# EAGLE design shieldArduino (EAGLE 9.6.2)
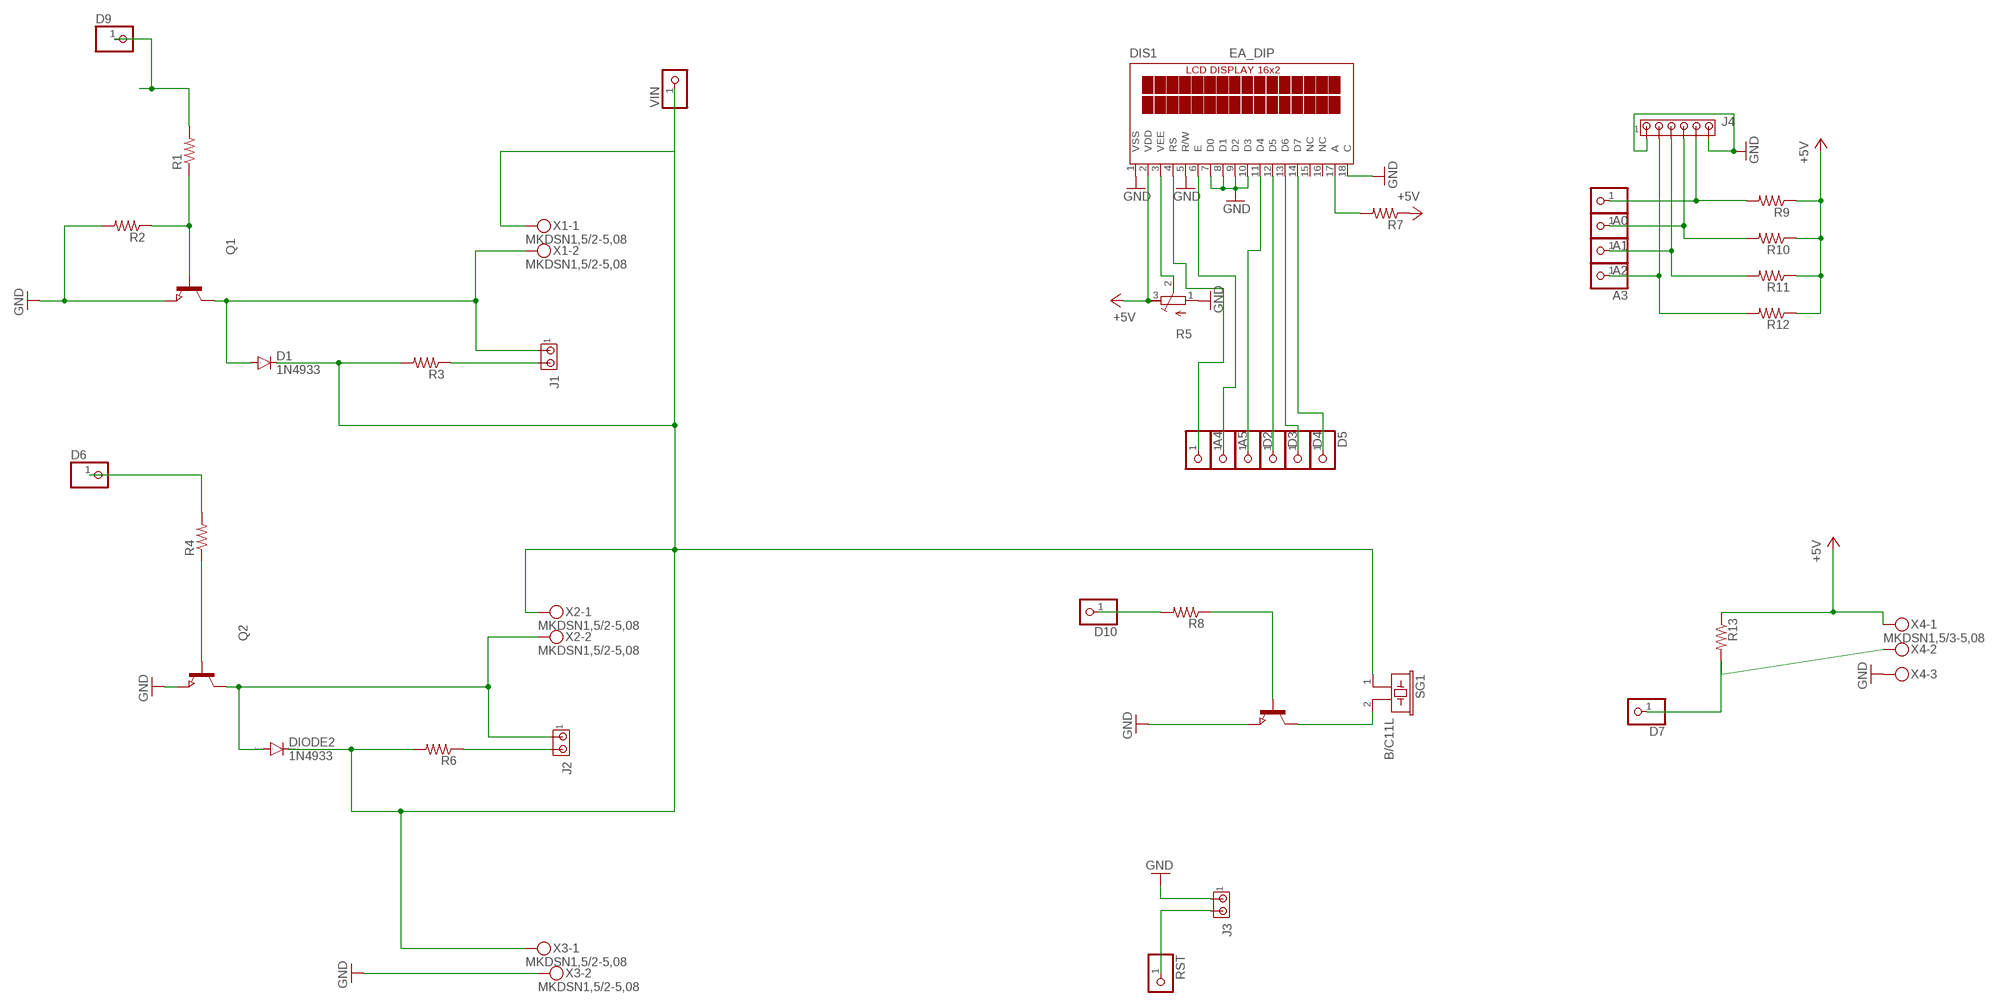
[diagram p0: schematic, sheet 1]

## Parts
A0  PINHD-1X1  [1X01]
A1  PINHD-1X1  [1X01]
A2  PINHD-1X1  [1X01]
A3  PINHD-1X1  [1X01]
A4  PINHD-1X1  [1X01]
A5  PINHD-1X1  [1X01]
D1  1N4933  [DO41-10]
D2  PINHD-1X1  [1X01]
D3  PINHD-1X1  [1X01]
D4  PINHD-1X1  [1X01]
D5  PINHD-1X1  [1X01]
D6  PINHD-1X1  [1X01]
D7  PINHD-1X1  [1X01]
D9  PINHD-1X1  [1X01]
D10  PINHD-1X1  [1X01]
DIODE2  1N4933  [DO41-10]
DIS1  EA_DIP  [EA_DIP]
J1  MTA02-156  [1X2MTA]
J2  MTA02-156  [1X2MTA]
J3  MTA02-156  [1X2MTA]
J4  MTA06-156  [1X6MTA]
Q1  NPN-TRANSISTOR_SOT23W  [SOT23W]
Q2  NPN-TRANSISTOR_SOT23W  [SOT23W]
Q3  NPN-TRANSISTOR_SOT23W  [SOT23W]
R1  R-US_0617/22  [0617/22]
R2  R-US_0617/22  [0617/22]
R3  R-US_0617/22  [0617/22]
R4  R-US_0617/22  [0617/22]
R5  R-TRIMM3339P  [RTRIM3339P]
R6  R-US_0617/22  [0617/22]
R7  R-US_0617/22  [0617/22]
R8  R-US_0617/22  [0617/22]
R9  R-US_0617/22  [0617/22]
R10  R-US_0617/22  [0617/22]
R11  R-US_0617/22  [0617/22]
R12  R-US_0617/22  [0617/22]
R13  R-US_0617/22  [0617/22]
RST  PINHD-1X1  [1X01]
SG1  B/C11L  [B/C11L]
VIN  PINHD-1X1  [1X01]
X1  MKDSN1,5/2-5,08  [MKDSN1,5/2-5,08]
X2  MKDSN1,5/2-5,08  [MKDSN1,5/2-5,08]
X3  MKDSN1,5/2-5,08  [MKDSN1,5/2-5,08]
X4  MKDSN1,5/3-5,08  [MKDSN1,5/3-5,08]

## Nets
+5V: DIS1.2(VDD) R5.3(E) R7.1 R9.1 R10.1 R11.1 R12.1 R13.1 X4.1
A4: A4.1 DIS1.4(RS)
D6: D6.1 R4.2
GND: DIS1.1(VSS) DIS1.5(R/W) DIS1.7(D0) DIS1.8(D1) DIS1.9(D2) DIS1.10(D3) DIS1.18(C) J3.1 J4.1 J4.6 Q1.3(E) Q2.3(E) Q3.3(E) R2.2 R5.1(A) X3.2 X4.3
N$1: Q1.1(B) R1.1 R2.1
N$2: D1.A J1.1 Q1.2(C) X1.2
N$3: J1.2 R3.1
N$4: D9.1 R1.2
N$5: Q2.1(B) R4.1
N$6: DIODE2.A J2.1 Q2.2(C) X2.2
N$7: J2.2 R6.1
N$8: A5.1 DIS1.6(E)
N$9: D2.1 DIS1.11(D4)
N$10: DIS1.3(VEE) R5.2(S)
N$11: D3.1 DIS1.12(D5)
N$12: D4.1 DIS1.13(D6)
N$13: D5.1 DIS1.14(D7)
N$14: DIS1.17(A) R7.2
N$15: Q3.1(B) R8.1
N$16: D10.1 R8.2
N$17: Q3.2(C) SG1.2
N$18: J3.2 RST.1
N$19: A0.1 J4.5 R9.2
N$20: A1.1 J4.4 R10.2
N$21: A2.1 J4.3 R11.2
N$22: A3.1 J4.2 R12.2
N$23: D7.1 R13.2 X4.2
VIN: D1.C DIODE2.C R3.2 R6.2 SG1.1 VIN.1 X1.1 X2.1 X3.1
Unconnected: DIS1.15(NC) DIS1.16(NC)

## Library data of the parts
A0 A1-A5 D2-D7 D9 D10 RST VIN = pinhead:PINHD-1X1: PIN HEADER
D1 DIODE2 = diode:1N4933: DIODE fast recovery rectifier, 1A
DIS1 = display-lcd:EA_DIP: LCD-MODUL 2x16 - 6,68mm, INKL. KONTROLLER HD44780 Source: Data sheet <http://www.lcd-module.de/pdf/doma/dip162-d.pdf>
J1-J3 = con-amp:MTA02-156: AMP connector
J4 = con-amp:MTA06-156: AMP connector
Q1-Q3 = semicon-smd-ipc:NPN-TRANSISTOR_: NPN TRANSISTOR
R1-R4 R6-R13 = rcl:R-US_: RESISTOR, American symbol; SPICEPREFIX: R
R5 = rcl:R-TRIMM: Trimm resistor; SPICEMODEL: X; SPICEPREFIXL: POT
SG1 = buzzer:B/C11L: BUZZER Source: Buerklin; OC_FARNELL: unknown; OC_NEWARK: unknown
X1-X3 = con-phoenix-508:MKDSN1,5/2-5,08: MKDSN 1,5/ 2-5,08 Printklemme Nennstrom: 13,5 A Nennspannung: 250 V Rastermaß: 5,08 mm Polzahl: 2 Anschlussart: Schraubanschluss Montage: Löten Anschlussrichtung Leiter/Platine: 0 ° Artikelnummer: 1729128 Source: http://eshop.phoenixcontact.com .. 1729128.pdf
X4 = con-phoenix-508:MKDSN1,5/3-5,08: MKDSN 1,5/ 3-5,08 Printklemme Nennstrom: 13,5 A Nennspannung: 250 V Rastermaß: 5,08 mm Polzahl: 3 Anschlussart: Schraubanschluss Montage: Löten Anschlussrichtung Leiter/Platine: 0 ° Artikelnummer: 1729131 Source: http://eshop.phoenixcontact.com .. 1729131.pdf

## Board
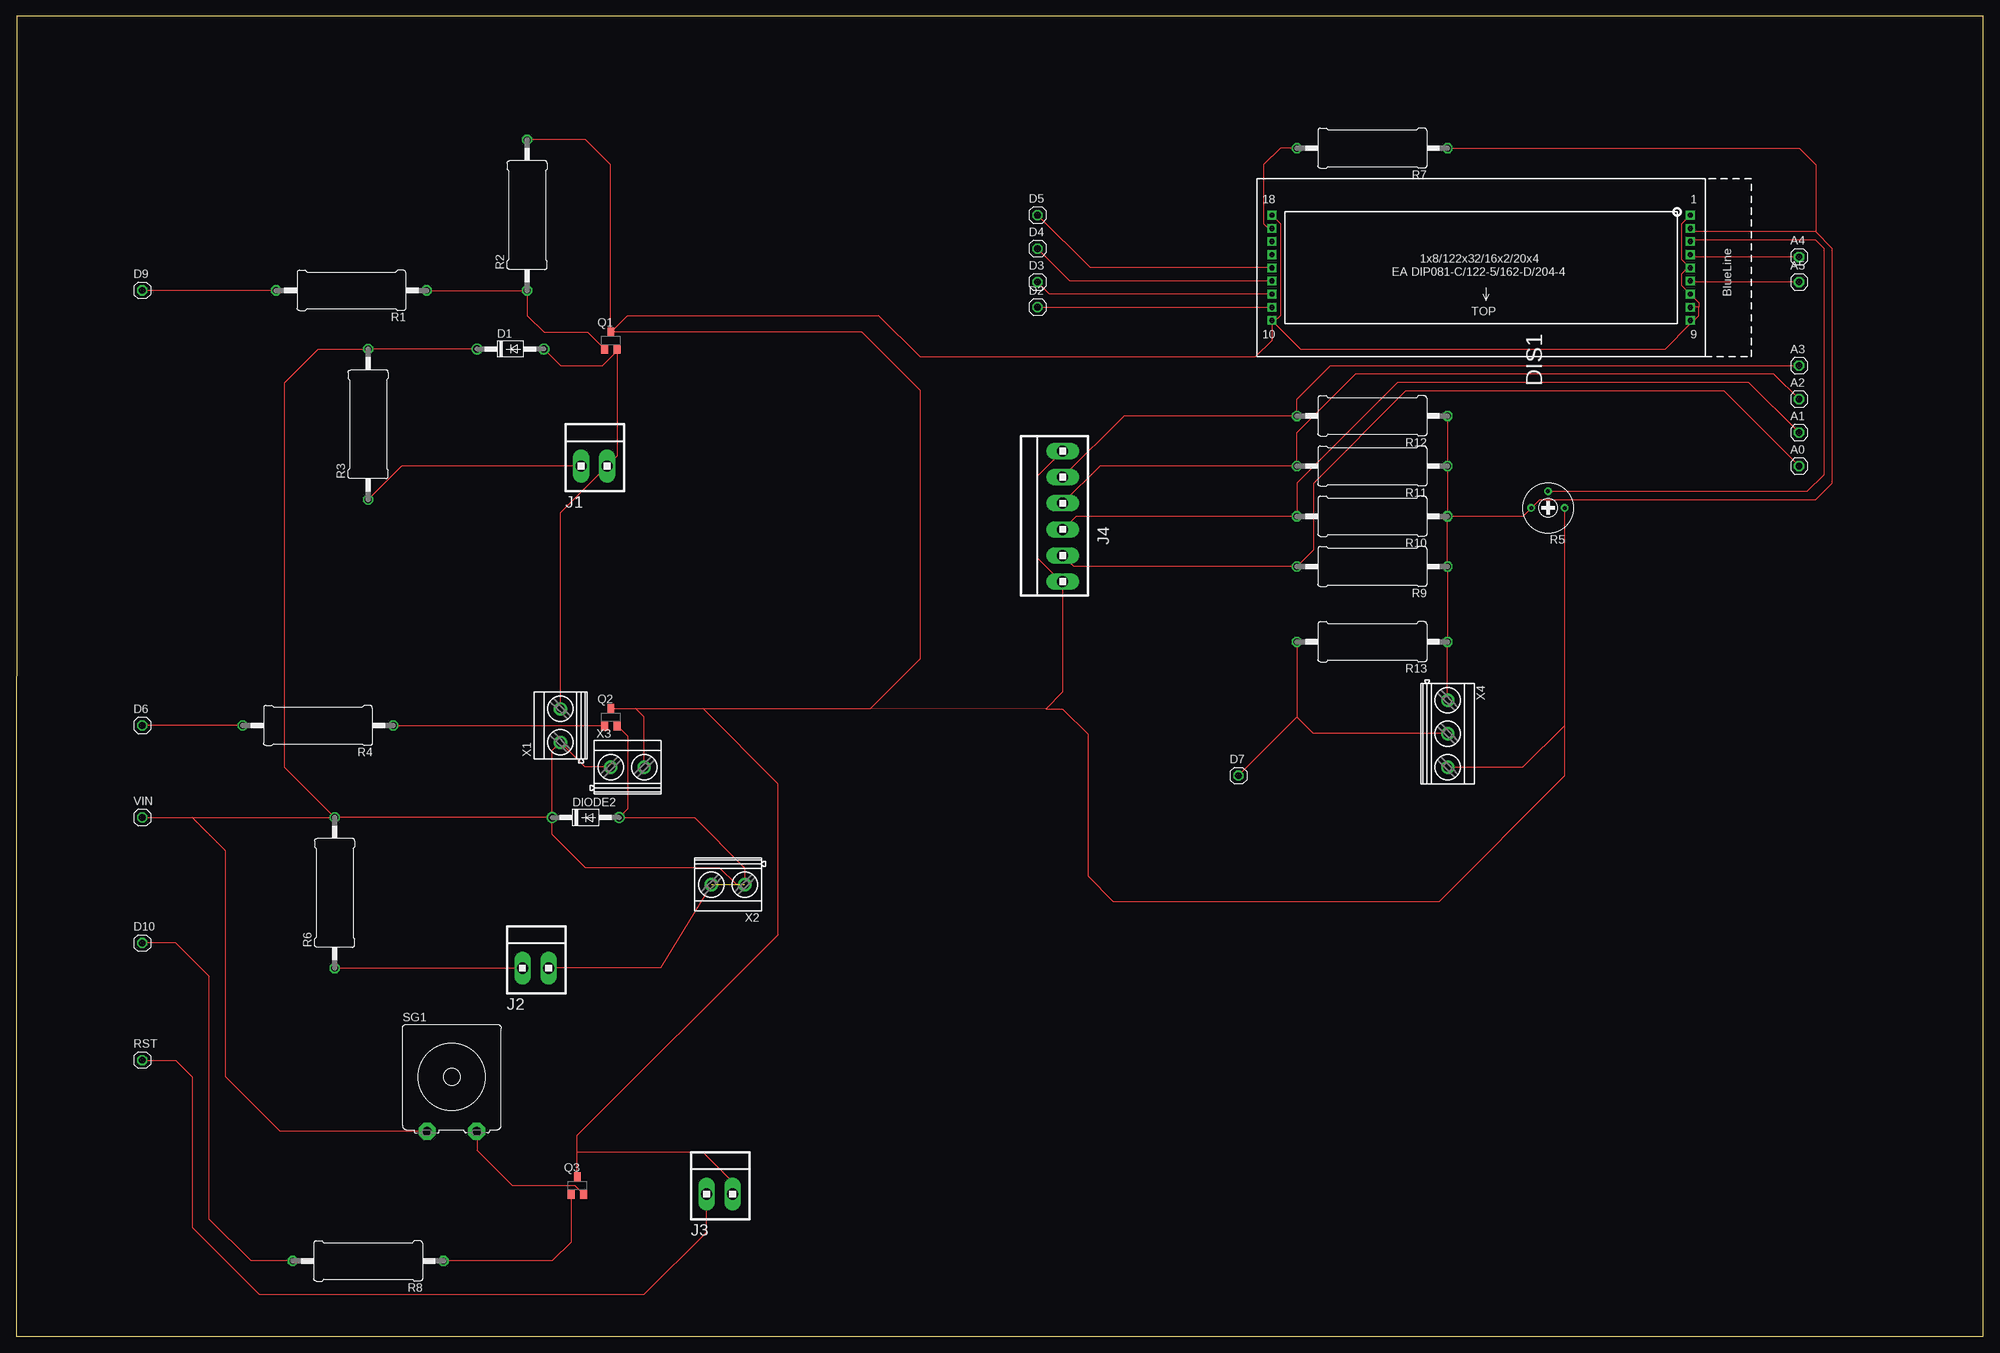
[diagram p1: board, top side]

Size 298.46 x 200.34 mm. Coordinates in mm from the lower left corner, seen from the top.
Outline: 0.03,200.34 0,0.01 0.64,0 298.46,0.01 298.46,200.34 0.03,200.34
Copper layers (1*16): Top 0.035mm / dielectric 1.5mm / Bottom 0.035mm
Design rules "default": minimum track width 6mil, minimum drill 0.35mm, track to track 6mil, track to pad 6mil, pad to pad 6mil, via to via 6mil, smd to smd 6mil, copper to edge 40mil, drill to drill 6mil, minimum pad ring 10mil, minimum via ring 8mil, stop-mask expansion 4mil, vias tented up to drill 0mil, thermal gap 10mil

### Footprints (pad centres in the part's own frame; a part is rotated, then mirrored left to right if it is on the bottom)
1X01 = drill 1.016 octagon: 1 0,0
DO41-10 = drill 1.118: A 5.08,0; C -5.08,0
EA_DIP = drill 0.813 pad 1.27 square: 1 0,0; 2 0,2; 3 0,4; 4 0,6; 5 0,8; 6 0,10; 7 0,12; 8 0,14; 9 0,16; 10 63.5,16; 11 63.5,14; 12 63.5,12; 13 63.5,10; 14 63.5,8; 15 63.5,6; 16 63.5,4; 17 63.5,2; 18 63.5,0
1X2MTA = drill 1.676 long: 1 1.981,0; 2 -1.981,0
1X6MTA = drill 1.676 long: 1 9.906,0; 2 5.944,0; 3 1.981,0; 4 -1.981,0; 5 -5.944,0; 6 -9.906,0
SOT23W = smd 1 x 1.4: 1 -0.95,-1.303; 2 0.95,-1.303; 3 0,1.303
0617/22 = drill 1.016 octagon: 1 -11.43,0; 2 11.43,0
RTRIM3339P = drill 0.61: 1 -2.54,0; 2 0,-2.54; 3 2.54,0
B/C11L = drill 1.321 pad 2.54 octagon: 1 -3.759,-8.255; 2 3.759,-8.255
MKDSN1,5/2-5,08 = drill 1.3 pad 2: 1 -2.561,0.025; 2 2.519,0.025
MKDSN1,5/3-5,08 = drill 1.3 pad 2: 1 -7.641,0.025; 2 -2.561,0.025; 3 2.519,0.025

### Placement (x,y rotation side)
A0  270.54,132.09 0 top
A1  270.54,137.17 0 top
A2  270.54,142.25 0 top
A3  270.54,147.33 0 top
A4  270.54,163.84 0 top
A5  270.54,160.03 0 top
D1  74.96,149.87 0 top
D2  154.97,156.22 0 top
D3  154.97,160.03 0 top
D4  154.97,165.11 0 top
D5  154.97,170.19 0 top
D6  19.08,92.72 0 top
D7  185.45,85.1 0 top
D9  19.08,158.76 0 top
D10  19.08,59.7 0 top
DIODE2  86.39,78.75 0 top
DIS1  254.03,170.19 180 top
J1  87.66,132.09 0 top
J2  78.77,55.89 0 top
J3  106.71,21.6 0 top
J4  158.78,124.47 90 top
Q1  90.2,151.14 0 top
Q2  90.2,93.99 0 top
Q3  85.12,22.87 0 top
R1  50.83,158.76 180 top
R2  77.5,170.19 90 top
R3  53.37,138.44 90 top
R4  45.75,92.72 180 top
R5  232.44,125.74 180 top
R6  48.29,67.32 90 top
R7  205.77,180.35 180 top
R8  53.37,11.44 180 top
R9  205.77,116.85 180 top
R10  205.77,124.47 180 top
R11  205.77,132.09 180 top
R12  205.77,139.71 180 top
R13  205.77,105.42 180 top
RST  19.08,41.92 0 top
SG1  66.07,39.38 0 top
VIN  19.08,78.75 0 top
X1  82.58,92.72 90 top
X2  107.98,68.59 180 top
X3  92.74,86.37 0 top
X4  217.2,88.91 270 top

### Tracks (layer width: path | path; a pad name or v marks a point on that pad's centre or on a via)
+5V
  Top 0.152: 273.08,167.65 275.62,165.11 275.62,129.55 273.08,127.01 231.17,127.01 R5.3 228.63,124.47 R10.1 | DIS1.2 254.57,167.65 273.08,167.65 | R7.1 270.54,180.35 273.08,177.81 273.08,167.65 | R12.1 R11.1 R10.1 | R10.1 R9.1 R13.1 217.2,96.57 X4.1
A4
  Top 0.152: A4.1 254.38,163.84 DIS1.4
D6
  Top 0.152: R4.2 D6.1
GND
  Top 0.152: 104.17,95.29 Q2.3 93.98,95.29 95.26,94.01 X3.2 | 104.17,95.29 129.61,95.29 | Q1.3 90.24,152.41 128.3,152.41 137.19,143.52 137.19,102.88 129.61,95.29 | 129.61,95.29 129.6,95.28 156.24,95.26 | Q1.3 90.2,177.81 86.39,181.62 R2.2 | Q1.3 90.24,152.44 92.74,154.95 130.84,154.95 137.19,148.6 187.99,148.6 190.53,151.14 DIS1.10 190.79,153.93 | 156.24,95.26 158.78,95.25 162.59,91.44 162.59,69.86 166.4,66.05 215.93,66.05 234.98,85.1 234.98,92.72 | 190.79,153.93 194.85,149.87 250.22,149.87 254.03,153.68 DIS1.9 254.54,154.19 255.3,154.95 255.3,156.22 | 255.3,156.22 254.06,156.22 DIS1.8 | 255.3,156.22 255.3,156.92 DIS1.7 252.76,159.46 252.76,161.3 253.65,162.19 DIS1.5 252.76,163.46 252.76,168.92 DIS1.1 | DIS1.18 191.8,168.92 191.8,154.95 190.79,153.93 | 104.17,95.29 115.6,83.86 115.6,60.97 85.12,30.49 85.12,27.95 | J3.1 108.69,23.42 104.17,27.95 85.12,27.95 | Q3.3 85.12,27.95 | J4.1 154.97,130.56 154.97,118.12 158.53,114.56 J4.6 158.78,97.8 156.24,95.26 | 234.98,92.72 R5.1 | X4.3 228.65,86.39 234.98,92.72
N$1
  Top 0.152: Q1.1 86.68,152.41 80.04,152.41 77.5,154.95 R2.1 R1.1
N$2
  Top 0.152: D1.A 82.58,147.33 88.93,147.33 91.15,149.55 Q1.2 91.15,133.59 89.92,132.36 J1.1 82.56,125 X1.2
N$3
  Top 0.152: J1.2 58.45,132.09 R3.1
N$4
  Top 0.152: R1.2 D9.1
N$5
  Top 0.152: R4.1 89.22,92.72 Q2.1
N$6  (1 unrouted)
  Top 0.152: DIODE2.A 102.9,78.75 110.52,71.13 110.52,68.59 | X2.2 97.78,55.89 J2.1 | DIODE2.A 91.15,79.07 | Q2.2 92.74,91.09 92.74,80.02 DIODE2.A
N$7
  Top 0.152: R6.1 J2.2
N$8
  Top 0.152: A5.1 254.19,160.03 DIS1.6
N$9
  Top 0.152: D2.1 190.5,156.22 DIS1.11
N$10
  Top 0.152: R5.2 271.81,128.28 274.35,130.82 274.35,165.11 273.08,166.38 254.22,166.38 DIS1.3
N$11
  Top 0.152: DIS1.12 156.81,158.19 D3.1
N$12
  Top 0.152: DIS1.13 159.89,160.19 D4.1
N$13
  Top 0.152: DIS1.14 162.97,162.19 D5.1
N$14
  Top 0.152: R7.2 191.8,180.35 189.26,177.81 189.26,168.92 189.99,168.19 DIS1.17
N$15
  Top 0.152: Q3.1 84.17,14.3 81.31,11.44 R8.1
N$16
  Top 0.152: R8.2 35.59,11.44 29.24,17.79 29.24,54.62 24.16,59.7 D10.1
N$17
  Top 0.152: SG1.2 69.88,31.07 69.88,28.23 75.28,22.83 84.8,22.83 Q3.2
N$18
  Top 0.152: RST.1 24.16,41.92 26.7,39.38 26.7,16.52 36.86,6.36 95.28,6.36 104.73,15.8 J3.2
N$19
  Top 0.152: J4.5 160.46,116.85 R9.2 196.88,119.39 196.88,129.55 210.85,143.52 259.11,143.52 A0.1
N$20
  Top 0.152: J4.4 160.76,124.47 R10.2 194.34,129.55 209.58,144.79 262.92,144.79 A1.1
N$21
  Top 0.152: J4.3 164.42,132.09 R11.2 194.34,137.17 203.23,146.06 266.73,146.06 A2.1
N$22
  Top 0.152: J4.2 168.08,139.71 R12.2 194.34,142.25 199.42,147.33 A3.1
N$23
  Top 0.152: 194.34,93.99 D7.1 | R13.2 194.34,93.99 | X4.2 196.86,91.47 194.34,93.99
VIN
  Top 0.152: R6.2 40.67,86.37 40.67,144.79 45.75,149.87 R3.2 D1.C | DIODE2.C R6.2 | X2.1 109.28,68.56 106.71,71.13 86.39,71.13 81.31,76.21 DIODE2.C | VIN.1 26.7,78.75 | 26.7,78.75 R6.2 | SG1.1 40.04,31.12 31.78,39.38 31.78,73.67 26.7,78.75 | X3.1 86.32,86.39 X1.1 | X1.1 | DIODE2.C 81.31,88.91 X1.1